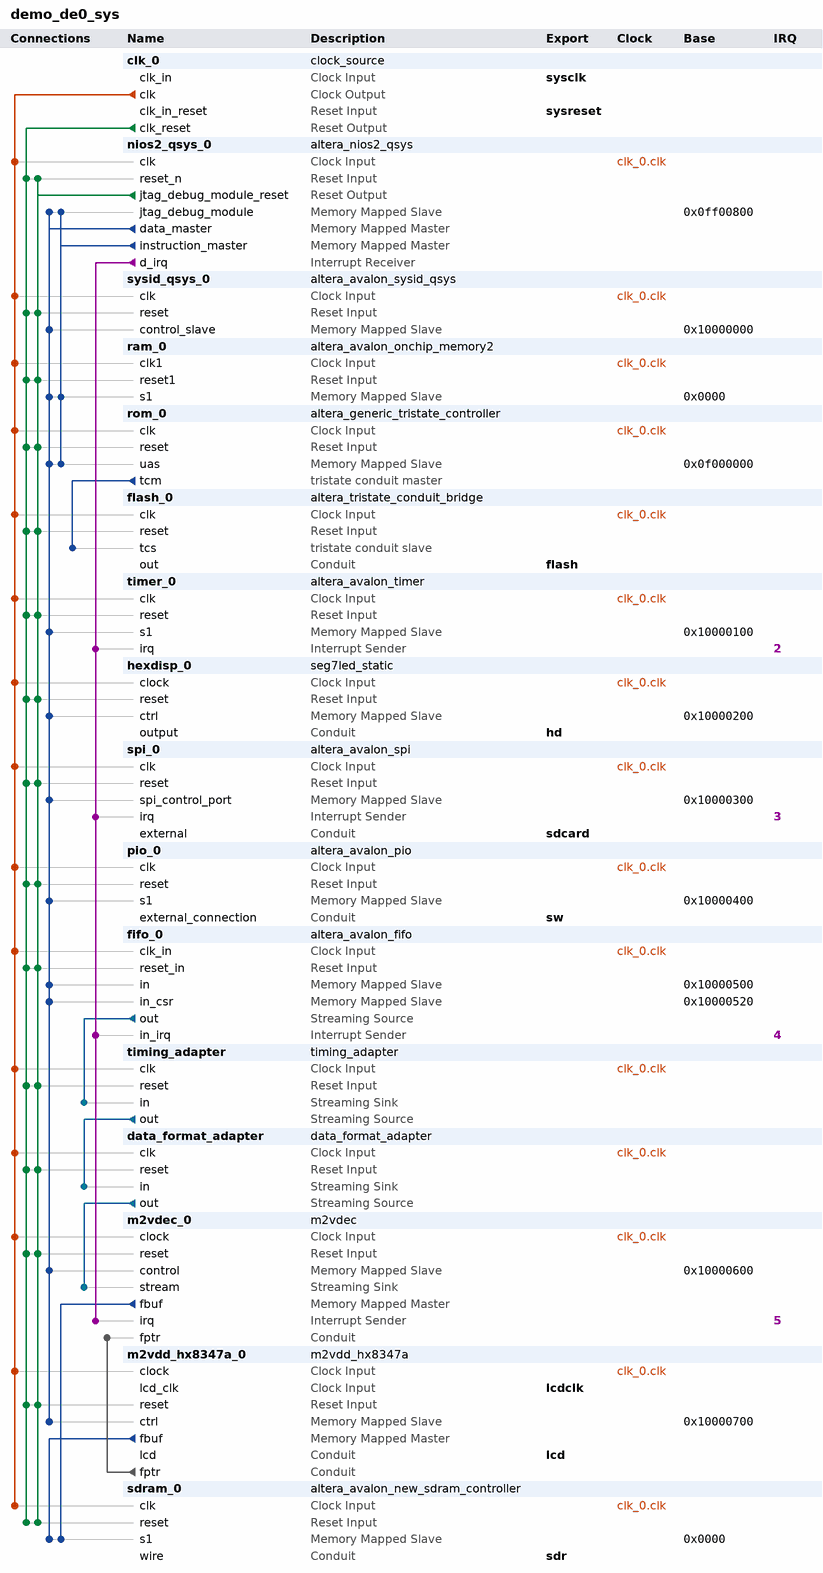
[diagram p0: system contents]
# Platform Designer (Qsys) system demo_de0_sys, CYCLONEIII EP3C16F484C6
# Parameters at their usual value, and those the tool derives, are not listed.
package require -exact qsys 11.1
create_system demo_de0_sys
set_project_property DEVICE_FAMILY CYCLONEIII
set_project_property DEVICE EP3C16F484C6

add_instance clk_0 clock_source 11.1
set_instance_parameter_value clk_0 clockFrequency 100000000
set_instance_parameter_value clk_0 resetSynchronousEdges BOTH

add_instance nios2_qsys_0 altera_nios2_qsys 11.1
set_instance_parameter_value nios2_qsys_0 resetSlave rom_0.uas
set_instance_parameter_value nios2_qsys_0 exceptionSlave rom_0.uas
set_instance_parameter_value nios2_qsys_0 breakSlave nios2_qsys_0.jtag_debug_module
set_instance_parameter_value nios2_qsys_0 impl Tiny
set_instance_parameter_value nios2_qsys_0 icache_size 4096

add_instance sysid_qsys_0 altera_avalon_sysid_qsys 11.1
set_instance_parameter_value sysid_qsys_0 id 1278338

add_instance ram_0 altera_avalon_onchip_memory2 11.1
set_instance_parameter_value ram_0 dataWidth 32
set_instance_parameter_value ram_0 dualPort false
set_instance_parameter_value ram_0 initMemContent true
set_instance_parameter_value ram_0 initializationFileName ram_0
set_instance_parameter_value ram_0 memorySize 8192

add_instance rom_0 altera_generic_tristate_controller 11.1
set_instance_parameter_value rom_0 TCM_ADDRESS_W 22
set_instance_parameter_value rom_0 TCM_DATA_W 16
set_instance_parameter_value rom_0 TCM_BYTEENABLE_W 2
set_instance_parameter_value rom_0 TCM_READ_WAIT 70
set_instance_parameter_value rom_0 TCM_WRITE_WAIT 70
set_instance_parameter_value rom_0 TCM_SETUP_WAIT 35
set_instance_parameter_value rom_0 TCM_DATA_HOLD 0
set_instance_parameter_value rom_0 TCM_MAX_PENDING_READ_TRANSACTIONS 3
set_instance_parameter_value rom_0 TCM_TURNAROUND_TIME 2
set_instance_parameter_value rom_0 TCM_TIMING_UNITS 0
set_instance_parameter_value rom_0 TCM_READLATENCY 2
set_instance_parameter_value rom_0 TCM_SYMBOLS_PER_WORD 2
set_instance_parameter_value rom_0 USE_READ 1
set_instance_parameter_value rom_0 USE_BEGINTRANSFER 0
set_instance_parameter_value rom_0 USE_BYTEENABLE 0
set_instance_parameter_value rom_0 USE_OUTPUTENABLE 0
set_instance_parameter_value rom_0 ACTIVE_LOW_READ 1
set_instance_parameter_value rom_0 ACTIVE_LOW_BYTEENABLE 0
set_instance_parameter_value rom_0 ACTIVE_LOW_OUTPUTENABLE 0
set_instance_parameter_value rom_0 ACTIVE_LOW_BEGINTRANSFER 0
set_instance_parameter_value rom_0 CHIPSELECT_THROUGH_READLATENCY 0
set_instance_parameter_value rom_0 MODULE_ASSIGNMENT_KEYS embeddedsw.configuration.hwClassnameDriverSupportList,embeddedsw.configuration.hwClassnameDriverSupportDefault,embeddedsw.CMacro.SETUP_VALUE,embeddedsw.CMacro.WAIT_VALUE,embeddedsw.CMacro.HOLD_VALUE,embeddedsw.CMacro.TIMING_UNITS,embeddedsw.CMacro.SIZE,embeddedsw.memoryInfo.MEM_INIT_DATA_WIDTH,embeddedsw.memoryInfo.HAS_BYTE_LANE,embeddedsw.memoryInfo.IS_FLASH,embeddedsw.memoryInfo.GENERATE_DAT_SYM,embeddedsw.memoryInfo.GENERATE_FLASH,embeddedsw.memoryInfo.DAT_SYM_INSTALL_DIR,embeddedsw.memoryInfo.FLASH_INSTALL_DIR
set_instance_parameter_value rom_0 MODULE_ASSIGNMENT_VALUES altera_avalon_lan91c111:altera_avalon_cfi_flash,altera_avalon_cfi_flash,35,70,35,ns,1048576u,16,1,1,1,1,SIM_DIR,APP_DIR
set_instance_parameter_value rom_0 INTERFACE_ASSIGNMENT_KEYS embeddedsw.configuration.isFlash,embeddedsw.configuration.isMemoryDevice,embeddedsw.configuration.isNonVolatileStorage
set_instance_parameter_value rom_0 INTERFACE_ASSIGNMENT_VALUES 1,1,1

add_instance flash_0 altera_tristate_conduit_bridge 11.1

add_instance timer_0 altera_avalon_timer 11.1
set_instance_parameter_value timer_0 alwaysRun true
set_instance_parameter_value timer_0 fixedPeriod true
set_instance_parameter_value timer_0 period 1
set_instance_parameter_value timer_0 periodUnits MSEC
set_instance_parameter_value timer_0 snapshot false
set_instance_parameter_value timer_0 timerPreset SIMPLE_PERIODIC_INTERRUPT

add_instance hexdisp_0 seg7led_static 1.0
set_instance_parameter_value hexdisp_0 DIGITS 4
set_instance_parameter_value hexdisp_0 ACTIVE_LOW 0

add_instance spi_0 altera_avalon_spi 11.1
set_instance_parameter_value spi_0 clockPolarity 0
set_instance_parameter_value spi_0 dataWidth 8
set_instance_parameter_value spi_0 masterSPI true
set_instance_parameter_value spi_0 numberOfSlaves 1
set_instance_parameter_value spi_0 targetClockRate 8000000

add_instance pio_0 altera_avalon_pio 11.1
set_instance_parameter_value pio_0 direction Input
set_instance_parameter_value pio_0 width 12

add_instance fifo_0 altera_avalon_fifo 11.1
set_instance_parameter_value fifo_0 bitsPerSymbol 8
set_instance_parameter_value fifo_0 channelWidth 0
set_instance_parameter_value fifo_0 errorWidth 0
set_instance_parameter_value fifo_0 fifoDepth 256
set_instance_parameter_value fifo_0 fifoInputInterfaceOptions AVALONMM_WRITE
set_instance_parameter_value fifo_0 fifoOutputInterfaceOptions AVALONST_SOURCE
set_instance_parameter_value fifo_0 singleClockMode true
set_instance_parameter_value fifo_0 singleResetMode true
set_instance_parameter_value fifo_0 symbolsPerBeat 4
set_instance_parameter_value fifo_0 useIRQ true
set_instance_parameter_value fifo_0 usePacket false
set_instance_parameter_value fifo_0 useReadControl false

add_instance timing_adapter timing_adapter 11.1
set_instance_parameter_value timing_adapter inBitsPerSymbol 8
set_instance_parameter_value timing_adapter inChannelWidth 0
set_instance_parameter_value timing_adapter inErrorWidth 0
set_instance_parameter_value timing_adapter inMaxChannel 0
set_instance_parameter_value timing_adapter inReadyLatency 1
set_instance_parameter_value timing_adapter inSymbolsPerBeat 4
set_instance_parameter_value timing_adapter inUseEmptyPort NO
set_instance_parameter_value timing_adapter inUsePackets false
set_instance_parameter_value timing_adapter inUseReady true
set_instance_parameter_value timing_adapter inUseValid true
set_instance_parameter_value timing_adapter outReadyLatency 0
set_instance_parameter_value timing_adapter outUseReady true
set_instance_parameter_value timing_adapter outUseValid true

add_instance data_format_adapter data_format_adapter 11.1
set_instance_parameter_value data_format_adapter generationLanguage VERILOG
set_instance_parameter_value data_format_adapter inBitsPerSymbol 8
set_instance_parameter_value data_format_adapter inChannelWidth 0
set_instance_parameter_value data_format_adapter inErrorWidth 0
set_instance_parameter_value data_format_adapter inMaxChannel 0
set_instance_parameter_value data_format_adapter inReadyLatency 0
set_instance_parameter_value data_format_adapter inSymbolsPerBeat 4
set_instance_parameter_value data_format_adapter inUseEmpty false
set_instance_parameter_value data_format_adapter inUseEmptyPort NO
set_instance_parameter_value data_format_adapter inUsePackets false
set_instance_parameter_value data_format_adapter inUseReady true
set_instance_parameter_value data_format_adapter outSymbolsPerBeat 1
set_instance_parameter_value data_format_adapter outUseEmpty false
set_instance_parameter_value data_format_adapter outUseEmptyPort NO

add_instance m2vdec_0 m2vdec 1.0
set_instance_parameter_value m2vdec_0 MEM_WIDTH 23
set_instance_parameter_value m2vdec_0 MVH_WIDTH 16
set_instance_parameter_value m2vdec_0 MVV_WIDTH 15
set_instance_parameter_value m2vdec_0 MBX_WIDTH 6
set_instance_parameter_value m2vdec_0 MBY_WIDTH 5
set_instance_parameter_value m2vdec_0 MBX_ADDER 6

add_instance m2vdd_hx8347a_0 m2vdd_hx8347a 1.0
set_instance_parameter_value m2vdd_hx8347a_0 MEM_WIDTH 23
set_instance_parameter_value m2vdd_hx8347a_0 MBX_WIDTH 6
set_instance_parameter_value m2vdd_hx8347a_0 MBY_WIDTH 5

add_instance sdram_0 altera_avalon_new_sdram_controller 11.1
set_instance_parameter_value sdram_0 TAC 5.5
set_instance_parameter_value sdram_0 TRCD 20.0
set_instance_parameter_value sdram_0 TRP 20.0
set_instance_parameter_value sdram_0 casLatency 3
set_instance_parameter_value sdram_0 columnWidth 8
set_instance_parameter_value sdram_0 dataWidth 16
set_instance_parameter_value sdram_0 generateSimulationModel true
set_instance_parameter_value sdram_0 model custom
set_instance_parameter_value sdram_0 numberOfBanks 4
set_instance_parameter_value sdram_0 numberOfChipSelects 1
set_instance_parameter_value sdram_0 powerUpDelay 100.0
set_instance_parameter_value sdram_0 refreshPeriod 15.625
set_instance_parameter_value sdram_0 rowWidth 12

# connections
add_connection clk_0.clk data_format_adapter.clk clock
add_connection clk_0.clk fifo_0.clk_in clock
add_connection clk_0.clk flash_0.clk clock
add_connection clk_0.clk hexdisp_0.clock clock
add_connection clk_0.clk m2vdd_hx8347a_0.clock clock
add_connection clk_0.clk m2vdec_0.clock clock
add_connection clk_0.clk nios2_qsys_0.clk clock
add_connection clk_0.clk pio_0.clk clock
add_connection clk_0.clk ram_0.clk1 clock
add_connection clk_0.clk rom_0.clk clock
add_connection clk_0.clk sdram_0.clk clock
add_connection clk_0.clk spi_0.clk clock
add_connection clk_0.clk sysid_qsys_0.clk clock
add_connection clk_0.clk timer_0.clk clock
add_connection clk_0.clk timing_adapter.clk clock
add_connection clk_0.clk_reset data_format_adapter.reset reset
add_connection clk_0.clk_reset fifo_0.reset_in reset
add_connection clk_0.clk_reset flash_0.reset reset
add_connection clk_0.clk_reset hexdisp_0.reset reset
add_connection clk_0.clk_reset m2vdd_hx8347a_0.reset reset
add_connection clk_0.clk_reset m2vdec_0.reset reset
add_connection clk_0.clk_reset nios2_qsys_0.reset_n reset
add_connection clk_0.clk_reset pio_0.reset reset
add_connection clk_0.clk_reset ram_0.reset1 reset
add_connection clk_0.clk_reset rom_0.reset reset
add_connection clk_0.clk_reset sdram_0.reset reset
add_connection clk_0.clk_reset spi_0.reset reset
add_connection clk_0.clk_reset sysid_qsys_0.reset reset
add_connection clk_0.clk_reset timer_0.reset reset
add_connection clk_0.clk_reset timing_adapter.reset reset
add_connection nios2_qsys_0.jtag_debug_module_reset data_format_adapter.reset reset
add_connection nios2_qsys_0.jtag_debug_module_reset fifo_0.reset_in reset
add_connection nios2_qsys_0.jtag_debug_module_reset flash_0.reset reset
add_connection nios2_qsys_0.jtag_debug_module_reset hexdisp_0.reset reset
add_connection nios2_qsys_0.jtag_debug_module_reset m2vdd_hx8347a_0.reset reset
add_connection nios2_qsys_0.jtag_debug_module_reset m2vdec_0.reset reset
add_connection nios2_qsys_0.jtag_debug_module_reset nios2_qsys_0.reset_n reset
add_connection nios2_qsys_0.jtag_debug_module_reset pio_0.reset reset
add_connection nios2_qsys_0.jtag_debug_module_reset ram_0.reset1 reset
add_connection nios2_qsys_0.jtag_debug_module_reset rom_0.reset reset
add_connection nios2_qsys_0.jtag_debug_module_reset sdram_0.reset reset
add_connection nios2_qsys_0.jtag_debug_module_reset spi_0.reset reset
add_connection nios2_qsys_0.jtag_debug_module_reset sysid_qsys_0.reset reset
add_connection nios2_qsys_0.jtag_debug_module_reset timer_0.reset reset
add_connection nios2_qsys_0.jtag_debug_module_reset timing_adapter.reset reset
add_connection m2vdd_hx8347a_0.fbuf sdram_0.s1 avalon
set_connection_parameter_value m2vdd_hx8347a_0.fbuf/sdram_0.s1 baseAddress 0x0000
add_connection m2vdec_0.fbuf sdram_0.s1 avalon
set_connection_parameter_value m2vdec_0.fbuf/sdram_0.s1 baseAddress 0x0000
add_connection nios2_qsys_0.data_master fifo_0.in avalon
set_connection_parameter_value nios2_qsys_0.data_master/fifo_0.in baseAddress 0x10000500
add_connection nios2_qsys_0.data_master fifo_0.in_csr avalon
set_connection_parameter_value nios2_qsys_0.data_master/fifo_0.in_csr baseAddress 0x10000520
add_connection nios2_qsys_0.data_master hexdisp_0.ctrl avalon
set_connection_parameter_value nios2_qsys_0.data_master/hexdisp_0.ctrl baseAddress 0x10000200
add_connection nios2_qsys_0.data_master m2vdd_hx8347a_0.ctrl avalon
set_connection_parameter_value nios2_qsys_0.data_master/m2vdd_hx8347a_0.ctrl baseAddress 0x10000700
add_connection nios2_qsys_0.data_master m2vdec_0.control avalon
set_connection_parameter_value nios2_qsys_0.data_master/m2vdec_0.control baseAddress 0x10000600
add_connection nios2_qsys_0.data_master nios2_qsys_0.jtag_debug_module avalon
set_connection_parameter_value nios2_qsys_0.data_master/nios2_qsys_0.jtag_debug_module baseAddress 0x0ff00800
add_connection nios2_qsys_0.data_master pio_0.s1 avalon
set_connection_parameter_value nios2_qsys_0.data_master/pio_0.s1 baseAddress 0x10000400
add_connection nios2_qsys_0.data_master ram_0.s1 avalon
set_connection_parameter_value nios2_qsys_0.data_master/ram_0.s1 baseAddress 0x0000
add_connection nios2_qsys_0.data_master rom_0.uas avalon
set_connection_parameter_value nios2_qsys_0.data_master/rom_0.uas baseAddress 0x0f000000
add_connection nios2_qsys_0.data_master spi_0.spi_control_port avalon
set_connection_parameter_value nios2_qsys_0.data_master/spi_0.spi_control_port baseAddress 0x10000300
add_connection nios2_qsys_0.data_master sysid_qsys_0.control_slave avalon
set_connection_parameter_value nios2_qsys_0.data_master/sysid_qsys_0.control_slave baseAddress 0x10000000
add_connection nios2_qsys_0.data_master timer_0.s1 avalon
set_connection_parameter_value nios2_qsys_0.data_master/timer_0.s1 baseAddress 0x10000100
add_connection nios2_qsys_0.instruction_master nios2_qsys_0.jtag_debug_module avalon
set_connection_parameter_value nios2_qsys_0.instruction_master/nios2_qsys_0.jtag_debug_module baseAddress 0x0ff00800
add_connection nios2_qsys_0.instruction_master ram_0.s1 avalon
set_connection_parameter_value nios2_qsys_0.instruction_master/ram_0.s1 baseAddress 0x0000
add_connection nios2_qsys_0.instruction_master rom_0.uas avalon
set_connection_parameter_value nios2_qsys_0.instruction_master/rom_0.uas baseAddress 0x0f000000
add_connection data_format_adapter.out m2vdec_0.stream avalon_streaming
add_connection fifo_0.out timing_adapter.in avalon_streaming
add_connection timing_adapter.out data_format_adapter.in avalon_streaming
add_connection m2vdd_hx8347a_0.fptr m2vdec_0.fptr conduit
add_connection nios2_qsys_0.d_irq fifo_0.in_irq interrupt
set_connection_parameter_value nios2_qsys_0.d_irq/fifo_0.in_irq irqNumber 4
add_connection nios2_qsys_0.d_irq m2vdec_0.irq interrupt
set_connection_parameter_value nios2_qsys_0.d_irq/m2vdec_0.irq irqNumber 5
add_connection nios2_qsys_0.d_irq spi_0.irq interrupt
set_connection_parameter_value nios2_qsys_0.d_irq/spi_0.irq irqNumber 3
add_connection nios2_qsys_0.d_irq timer_0.irq interrupt
set_connection_parameter_value nios2_qsys_0.d_irq/timer_0.irq irqNumber 2
add_connection rom_0.tcm flash_0.tcs tristate_conduit

# exported interfaces
add_interface sysclk clock sink
set_interface_property sysclk EXPORT_OF clk_0.clk_in
add_interface sysreset reset sink
set_interface_property sysreset EXPORT_OF clk_0.clk_in_reset
add_interface flash conduit end
set_interface_property flash EXPORT_OF flash_0.out
add_interface hd conduit end
set_interface_property hd EXPORT_OF hexdisp_0.output
add_interface lcd conduit end
set_interface_property lcd EXPORT_OF m2vdd_hx8347a_0.lcd
add_interface sdr conduit end
set_interface_property sdr EXPORT_OF sdram_0.wire
add_interface sdcard conduit end
set_interface_property sdcard EXPORT_OF spi_0.external
add_interface sw conduit end
set_interface_property sw EXPORT_OF pio_0.external_connection
add_interface lcdclk clock sink
set_interface_property lcdclk EXPORT_OF m2vdd_hx8347a_0.lcd_clk

save_system demo_de0_sys.qsys
